# EAGLE board dc26 (EAGLE 9.0.1), part 1 of 2
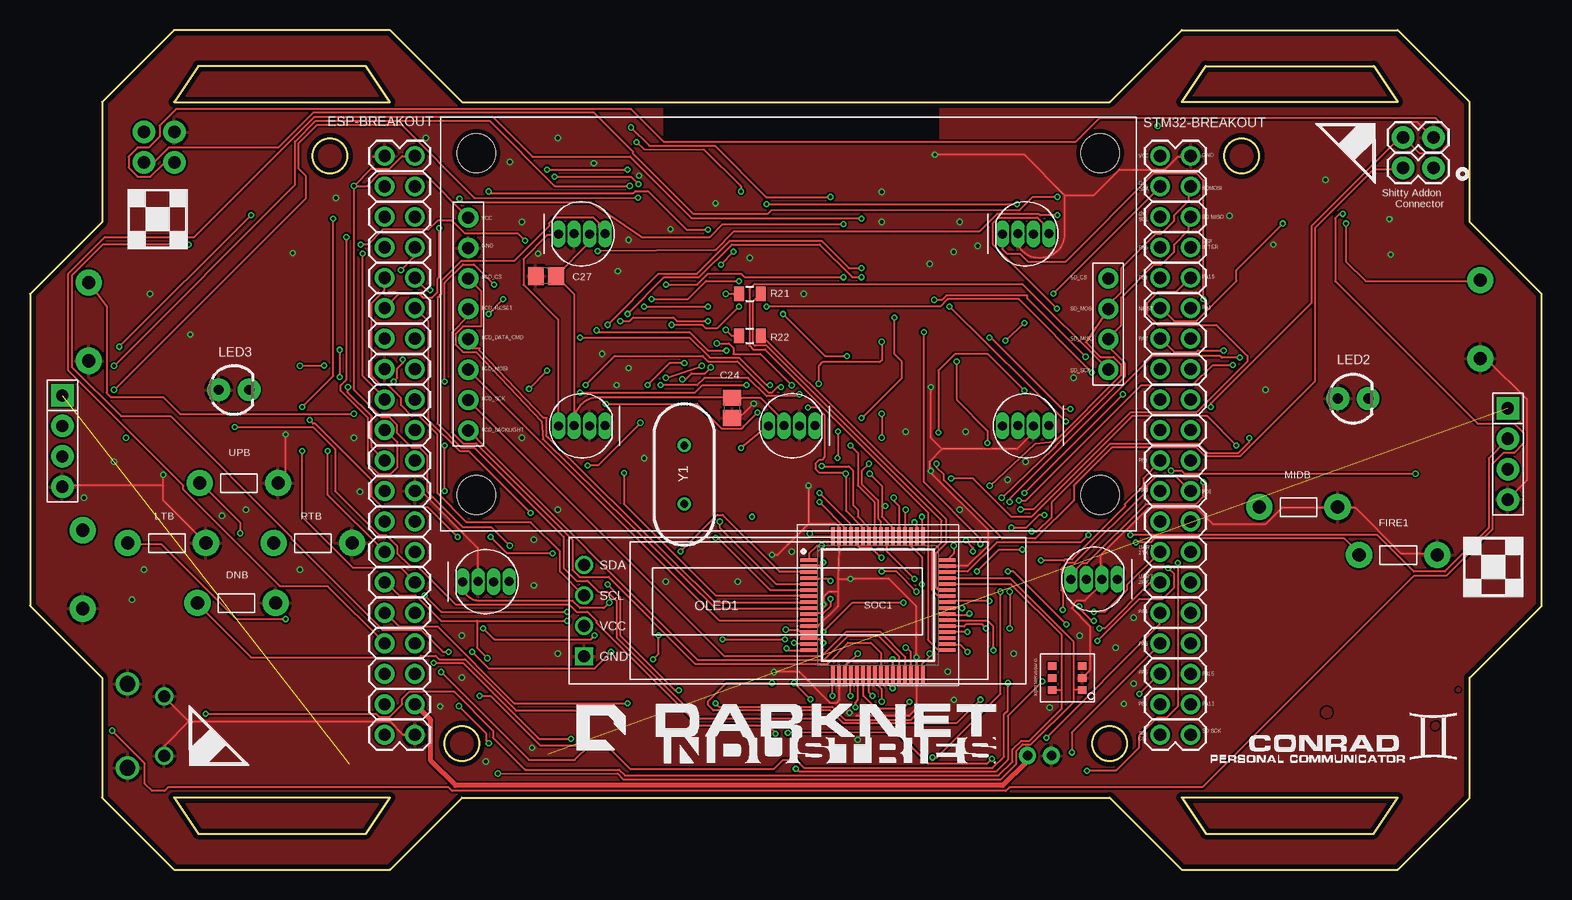
[diagram p7: board, top side]
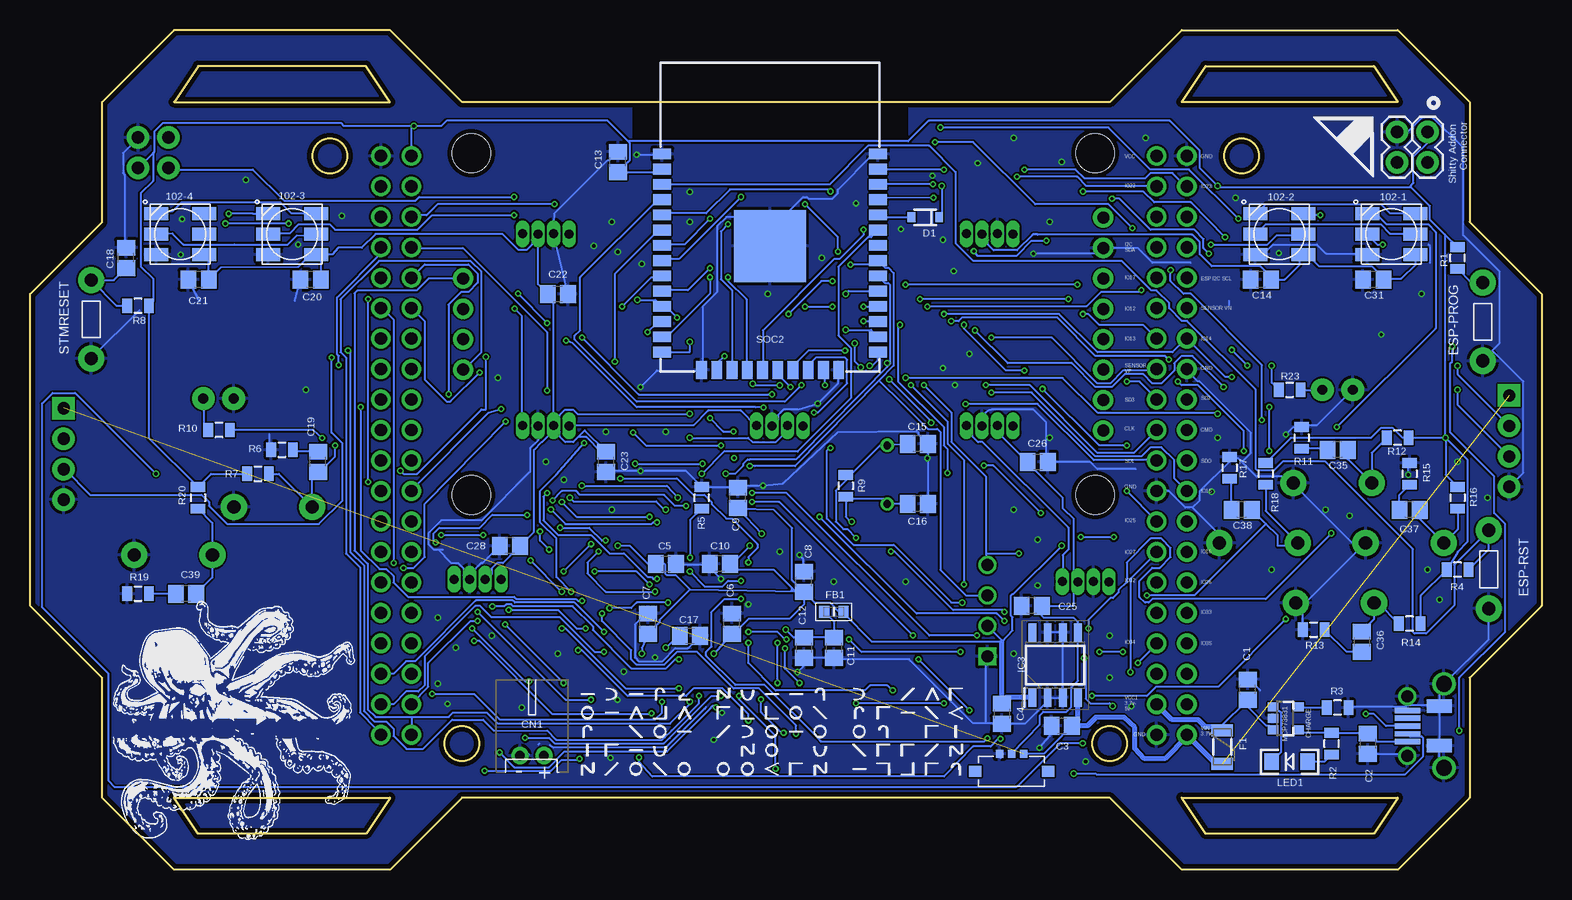
[diagram p8: board, bottom side, seen from below]

Size 126 x 70 mm. Coordinates in mm from the lower left corner, seen from the top.
Outline: 12,70 6,64 6,54 0,48 0,22 6,16 6,6 12,0 30,0 36,6 90,6 96,0 114,0 120,6 120,16 126,22 126,48 120,54 120,64 114,70 96,70 90,64 36,64 30,70 12,70
Outline: 28,67 14,67 12,64 30,64 28,67
Outline: 98,67 112,67 114,64 96,64 98,67
Outline: 14,3 28,3 30,6 12,6 14,3
Outline: 98,3 112,3 114,6 96,6 98,3
Outline: circle at 25,59.5 radius 1.43
Outline: circle at 36,10.5 radius 1.43
Outline: circle at 90,10.5 radius 1.43
Outline: circle at 101,59.5 radius 1.43
Copper layers (1*16): Top 0.035559375mm / dielectric 1.6mm / Bottom 0.035559375mm
Design rules "oshpark-2layer *": minimum track width 6mil, minimum drill 10mil, track to track 6mil, track to pad 6mil, pad to pad 6mil, via to via 6mil, smd to smd 6mil, copper to edge 15mil, drill to drill 6mil, minimum pad ring 5mil, minimum via ring 5mil, stop-mask expansion 2.5mil, vias tented up to drill 0.26mm, thermal gap 10mil

## Footprints (pad centres in the part's own frame; a part is rotated, then mirrored left to right if it is on the bottom)
APA102_5050 = smd 2 x 1.1: 1 2,-1.7; 2 2,0; 3 2,1.7; 4 -2,1.7; 5 -2,0; 6 -2,-1.7
WS2812F5_STRAIGHT = drill 0.75 pad 1.05 long: 1 1.95,0.005; 2 0.65,-0.005; 3 -0.65,0.005; 4 -1.95,-0.005
C0805 = smd 1.3 x 1.5: 1 -0.85,0; 2 0.85,0
SOT23-5 = smd 0.75 x 0.9: 1 -0.95,-1; 2 0,-1; 3 0.95,-1; 4 0.95,1.1; 5 -0.95,1.1
JST-PH-2-THM-RA = drill 0.8 pad 1.422: 1 1,0; 2 -1,0
SOD-323 = smd 0.63 x 0.83: 1 -1.15,0; 2 1.15,0
TACTILE-2PIN-NARROW = drill 1.1 pad 2.184: P$1 3.264,0; P$2 -3.264,0
SERIAL_HEADER_4 = drill 1.016 pad 1.88: GND 3.81,0; RX -1.27,0; TX 1.27,0 | drill 1.016 pad 1.88 square: VCC -3.81,0
2X20 = drill 1.016 pad 1.651: 1 -24.13,-1.27; 2 -24.13,1.27; 3 -21.59,-1.27; 4 -21.59,1.27; 5 -19.05,-1.27; 6 -19.05,1.27; 7 -16.51,-1.27; 8 -16.51,1.27; 9 -13.97,-1.27; 10 -13.97,1.27; 11 -11.43,-1.27; 12 -11.43,1.27; 13 -8.89,-1.27; 14 -8.89,1.27; 15 -6.35,-1.27; 16 -6.35,1.27; 17 -3.81,-1.27; 18 -3.81,1.27; 19 -1.27,-1.27; 20 -1.27,1.27; 21 1.27,-1.27; 22 1.27,1.27; 23 3.81,-1.27; 24 3.81,1.27; 25 6.35,-1.27; 26 6.35,1.27; 27 8.89,-1.27; 28 8.89,1.27; 29 11.43,-1.27; 30 11.43,1.27; 31 13.97,-1.27; 32 13.97,1.27; 33 16.51,-1.27; 34 16.51,1.27; 35 19.05,-1.27; 36 19.05,1.27; 37 21.59,-1.27; 38 21.59,1.27; 39 24.13,-1.27; 40 24.13,1.27
PTC-1206 = smd 1 x 1.8: 1 -1.4,0; 2 1.4,0
BEADC1608X75N = smd 0.85 x 1: 1 -0.8,0; 2 0.8,0
SOIC127P600X175-8N = smd 1.525 x 0.65: 1 -2.712,1.905; 2 -2.712,0.635; 3 -2.712,-0.635; 4 -2.712,-1.905; 5 2.712,-1.905; 6 2.712,-0.635; 7 2.712,0.635; 8 2.712,1.905
DC26SHITTY_ADDON_CONNECTOR = drill 1.016 pad 1.88: GND 0,-2.54; SCL 2.54,-2.54; SDA 2.54,0; VCC 0,0
ST7735S_LCD_DISPLAY = drill 1 pad 1.676: A0 1.27,-26.67; CS -3.81,-26.67; GND -6.35,-26.67; LED 8.89,-26.67; RESET -1.27,-26.67; SCK 6.35,-26.67; SD_CS -3.81,26.67; SD_MISO 1.27,26.67; SD_MOSI -1.27,26.67; SD_SCK 3.81,26.67; SDA 3.81,-26.67; VCC -8.89,-26.67 | hole 3.2: -14.25,26; 14.25,26; 14.25,-26; -14.25,-26
LED-1206 = smd 1.2 x 1.4: A -1.5,0; C 1.5,0
LED3MM = drill 0.813 pad 1.88: A -1.27,0; K 1.27,0
1X04 = drill 1.016 pad 1.88: GND 2.54,0; SWDCLK 0,0; SWDIO -2.54,0 | drill 1.016 pad 1.88 square: VCC -5.08,0
DISPLAY-OLED-128X32 = drill 1 square: 1 -17.78,-3.81 | drill 1: 2 -17.78,-1.27; 3 -17.78,1.27; 4 -17.78,3.81
SPDT_SSAJ120100 = smd 0.635 x 0.7: 1 -1,1.45; 2 1,1.45; C 0,1.45 | smd 1.05 x 0.9: MNT1 -3.05,0; MNT2 3.05,0
0805 = smd 0.8 x 1.2: 1 -0.9,0; 2 0.9,0
QFP50P1200X1200X160-64N = smd 1.475 x 0.3: 1 -5.738,3.75; 2 -5.738,3.25; 3 -5.738,2.75; 4 -5.738,2.25; 5 -5.738,1.75; 6 -5.738,1.25; 7 -5.738,0.75; 8 -5.738,0.25; 9 -5.738,-0.25; 10 -5.738,-0.75; 11 -5.738,-1.25; 12 -5.738,-1.75; 13 -5.738,-2.25; 14 -5.738,-2.75; 15 -5.738,-3.25; 16 -5.738,-3.75; 33 5.738,-3.75; 34 5.738,-3.25; 35 5.738,-2.75; 36 5.738,-2.25; 37 5.738,-1.75; 38 5.738,-1.25; 39 5.738,-0.75; 40 5.738,-0.25; 41 5.738,0.25; 42 5.738,0.75; 43 5.738,1.25; 44 5.738,1.75; 45 5.738,2.25; 46 5.738,2.75; 47 5.738,3.25; 48 5.738,3.75 | smd 0.3 x 1.475: 17 -3.75,-5.738; 18 -3.25,-5.738; 19 -2.75,-5.738; 20 -2.25,-5.738; 21 -1.75,-5.738; 22 -1.25,-5.738; 23 -0.75,-5.738; 24 -0.25,-5.738; 25 0.25,-5.738; 26 0.75,-5.738; 27 1.25,-5.738; 28 1.75,-5.738; 29 2.25,-5.738; 30 2.75,-5.738; 31 3.25,-5.738; 32 3.75,-5.738; 49 3.75,5.738; 50 3.25,5.738; 51 2.75,5.738; 52 2.25,5.738; 53 1.75,5.738; 54 1.25,5.738; 55 0.75,5.738; 56 0.25,5.738; 57 -0.25,5.738; 58 -0.75,5.738; 59 -1.25,5.738; 60 -1.75,5.738; 61 -2.25,5.738; 62 -2.75,5.738; 63 -3.25,5.738; 64 -3.75,5.738
ESP-WROOM-32 = smd 0.9 x 1.5: 1 7.7,9; 2 6.43,9; 3 5.16,9; 4 3.89,9; 5 2.62,9; 6 1.35,9; 7 0.08,9; 8 -1.19,9; 9 -2.46,9; 10 -3.73,9; 11 -5,9; 12 -6.27,9; 13 -7.54,9; 14 -8.81,9; 25 -8.81,-9; 26 -7.54,-9; 27 -6.27,-9; 28 -5,-9; 29 -3.73,-9; 30 -2.46,-9; 31 -1.19,-9; 32 0.08,-9; 33 1.35,-9; 34 2.62,-9; 35 3.89,-9; 36 5.16,-9; 37 6.43,-9; 38 7.7,-9 | smd 1.5 x 0.9: 15 -10.3,5.715; 16 -10.3,4.445; 17 -10.3,3.175; 18 -10.3,1.905; 19 -10.3,0.635; 20 -10.3,-0.635; 21 -10.3,-1.905; 22 -10.3,-3.175; 23 -10.3,-4.445; 24 -10.3,-5.715 | smd 6 x 6: GND 0,0
SOT-26P-XBP15SRV05W-G = smd 0.6 x 0.7: P1 -1,-1.25; P2 0,-1.25; P3 1,-1.25; P4 1,1.25; P5 0,1.25; P6 -1,1.25
DX4R005JJ2 = smd 2.1 x 0.45: +5V 0.72,-1.32; D+ 0.72,-0.02; D- 0.72,-0.67; GND 0.72,1.28; ID 0.72,0.63 | smd 2.1 x 1.1: P$6 3.35,1.65; P$8 3.35,-1.65 | drill 1: P$7 0.675,2.45; P$9 0.675,-2.5 | drill 1.3: P$10 3.75,-3.5; P$11 3.75,3.5
HC/49US_(AT49)PTH = drill 0.66 pad 1.1: 1 -2.44,0; 2 2.44,0

## Placement (x,y rotation side)
102-1  APA1025050  [APA102_5050]  12.53,52.98 0 bottom
102-2  APA1025050  [APA102_5050]  21.87,52.98 0 bottom
102-3  APA1025050  [APA102_5050]  104.13,52.98 0 bottom
102-4  APA1025050  [APA102_5050]  113.47,52.98 0 bottom
106-1  APA-106  [WS2812F5_STRAIGHT]  46,53 180 top
106-2  APA-106  [WS2812F5_STRAIGHT]  46,37 0 top
106-3  APA-106  [WS2812F5_STRAIGHT]  38,24 180 top
106-4  APA-106  [WS2812F5_STRAIGHT]  63.5,37 0 top
106-5  APA-106  [WS2812F5_STRAIGHT]  83,37 0 top
106-6  APA-106  [WS2812F5_STRAIGHT]  83,53 180 top
106-7  APA-106  [WS2812F5_STRAIGHT]  88.7,24.2 0 top
C1  4.7uF  [C0805]  24.5,15 90 bottom
C2  4.7uF  [C0805]  14.5,10.5 270 bottom
C3  1uF  [C0805]  40,12 0 bottom
C4  1uF  [C0805]  45,13 270 bottom
C5  100nF  [C0805]  73,25.5 0 bottom
C6  100nF  [C0805]  67.5,20.5 90 bottom
C7  100nF  [C0805]  74.5,20.5 90 bottom
C8  4.7uF  [C0805]  61.5,24 90 bottom
C9  100nF  [C0805]  67,31 90 bottom
C10  100nF  [C0805]  68.5,25.5 180 bottom
C11  100nF  [C0805]  59,18.5 270 bottom
C12  1uF  [C0805]  61.5,18.5 270 bottom
C13  10uF  [C0805]  77,59 90 bottom
C14  15pf  [C0805]  23.4,49.2 180 bottom
C15  20pf  [C0805]  52,35.5 180 bottom
C16  20pf  [C0805]  52,30.5 180 bottom
C17  4.7uF  [C0805]  71,19.5 0 bottom
C18  100nF  [C0805]  118,51 90 bottom
C19  100nF  [C0805]  102,34 90 bottom
C20  15pf  [C0805]  102.6,49.2 180 bottom
C21  15pf  [C0805]  111.95,49.2 180 bottom
C22  15pf  [C0805]  82,48 0 bottom
C23  15pf  [C0805]  78,34 270 bottom
C24  15pf  [C0805]  58.5,38.5 270 top
C25  15pf  [C0805]  42.5,22 180 bottom
C26  15pf  [C0805]  42,34 0 bottom
C27  15pf  [C0805]  43,49.5 180 top
C28  15pf  [C0805]  86,27 180 bottom
C31  15pf  [C0805]  14.03,49.2 180 bottom
C35  100nF  [C0805]  17,35 180 bottom
C36  100nF  [C0805]  15,19 270 bottom
C37  100nF  [C0805]  11,30 180 bottom
C38  100nF  [C0805]  25,30 180 bottom
C39  100nF  [C0805]  113,23 180 bottom
CHARGE  MCP73831  [SOT23-5]  21.38,12.6 270 bottom
CN1  JST  [JST-PH-2-THM-RA]  84.15,9.5 0 bottom
D1  1N4148WS  [SOD-323]  51.37,54.38 180 bottom
DNB  UserButton  [TACTILE-2PIN-NARROW]  17.22,22.22 0 top
ESP32PH  SERIAL_4  [SERIAL_HEADER_4]  2.7,35.72 270 top
ESP-BREAKOUT  M20X2  [2X20]  30.82,35.37 270 top
ESP-PROG  UserButton  [TACTILE-2PIN-NARROW]  4.9,45.68 90 bottom
ESP-RST  UserButton  [TACTILE-2PIN-NARROW]  4.4,25.02 90 bottom
F1  NANOSMDH075F-02  [PTC-1206]  26.61,10.22 270 bottom
FB1  BLM18TG221TN1D  [BEADC1608X75N]  59,21.5 180 bottom
FIRE1  UserButton  [TACTILE-2PIN-NARROW]  114.06,26.22 0 top
IC3  LDL112D33R  [SOIC127P600X175-8N]  40.54,17.05 90 bottom
J1  DC26 Shitty AddOn  [DC26SHITTY_ADDON_CONNECTOR]  117,58.5 180 top
J2  DC26 Shitty AddOn  [DC26SHITTY_ADDON_CONNECTOR]  9.5,61.5 270 bottom
LCD1  ST7735S_LCD_MODULE  [ST7735S_LCD_DISPLAY]  63.21,45.48 270 top
LED1  MF-LED-1206-GREEN  [LED-1206]  21,9 180 bottom
LED2  LED2-3MM  [LED3MM]  110.29,39.27 0 top
LED3  LED2-3MM  [LED3MM]  17,40 0 top
LINK1  STLINK-V2-CONNECTOR  [1X04]  123.2,33.38 270 top
LTB  UserButton  [TACTILE-2PIN-NARROW]  11.4,27.22 0 top
MIDB  UserButton  [TACTILE-2PIN-NARROW]  105.74,30.22 0 top
OLED1  DISPLAY-OLED-128X32  [DISPLAY-OLED-128X32]  63.98,21.58 0 top
P1  SPDT_SSAJ120100  [SPDT_SSAJ120100]  44.17,8.2 0 bottom
R1  10K  [0805]  7,51 90 bottom
R2  470  [0805]  17.5,10.5 90 bottom
R3  2k  [0805]  17,13.5 180 bottom
R4  10K  [0805]  7,25 180 bottom
R5  10K  [0805]  70,31 90 bottom
R6  100  [0805]  105,35 0 bottom
R7  4K7  [0805]  107,33 0 bottom
R8  4K7  [0805]  117,47 180 bottom
R9  1M  [0805]  58,32 270 bottom
R10  56  [0805]  110.25,36.65 180 bottom
R11  100  [0805]  20,36 270 bottom
R12  4K7  [0805]  12,36 180 bottom
R13  100  [0805]  19,20 0 bottom
R14  4K7  [0805]  11,20.5 180 bottom
R15  100  [0805]  11,33 270 bottom
R16  4K7  [0805]  7,31 270 bottom
R17  100  [0805]  26,33.5 270 bottom
R18  4K7  [0805]  23,33 270 bottom
R19  100  [0805]  117,23 0 bottom
R20  4K7  [0805]  112,31 270 bottom
R21  100  [0805]  60,48 0 top
R22  100  [0805]  60,44.5 0 top
R23  56  [0805]  21,40 0 bottom
RTB  UserButton  [TACTILE-2PIN-NARROW]  23.58,27.22 0 top
SOC1  STM32F411RET6  [QFP50P1200X1200X160-64N]  70.69,22.04 0 top
SOC2  ESP-WROOM-32  [ESP-WROOM-32]  64.3,51.96 90 bottom
STM32-BREAKOUT  M20X2  [2X20]  95.48,35.37 270 top
STMRESET  UserButton  [TACTILE-2PIN-NARROW]  120.9,45.88 270 bottom
U$1  KRUX_LOGO  [KRUX_LOGO]  107.36,45.94 0 bottom
U$2  CMD_C0DE_LOGO  [CMD_C0DE_LOGO]  18.57,45.43 0 bottom
U$3  DC26_KRUX_PUZZLE_1  [DN26_KRUX_PUZZLE_1]  110.06,11.54 0 bottom
U$4  DC26_KRUX_PUZZLE_2  [DN26_KRUX_PUZZLE_2]  64.16,11.51 0 bottom
U$5  CONRAD_LOGO  [CONRAD_LOGO]  110.66,11.99 0 top
U$6  DN_LOGODC26  [DN_LOGO_DC26]  63.04,11.32 0 top
U$7  FIDUCIAL_DNBOX  [FIDUCIAL_BOX]  121.96,25.23 0 top
U$8  FIDUCIAL_DNBOX  [FIDUCIAL_BOX]  10.63,54.24 0 top
U$9  FIDUCIAL_DNCORNER  [FIDUCIAL_CORNER]  109.63,59.71 270 top
U$10  FIDUCIAL_DNCORNER  [FIDUCIAL_CORNER]  15.79,11.18 90 top
U$11  FIDUCIAL_DNCORNER  [FIDUCIAL_CORNER]  16.53,60.22 270 bottom
U$17  XBP15SRV05W-G  [SOT-26P-XBP15SRV05W-G]  86.46,15.96 90 top
UPB  UserButton  [TACTILE-2PIN-NARROW]  17.42,32.22 0 top
USB  DX4R005JJ2DX4R005JJ2  [DX4R005JJ2]  11.88,11.98 0 bottom
Y1  ABL-8.000MHZ-B2  [HC/49US_(AT49)PTH]  54.54,32.93 270 top